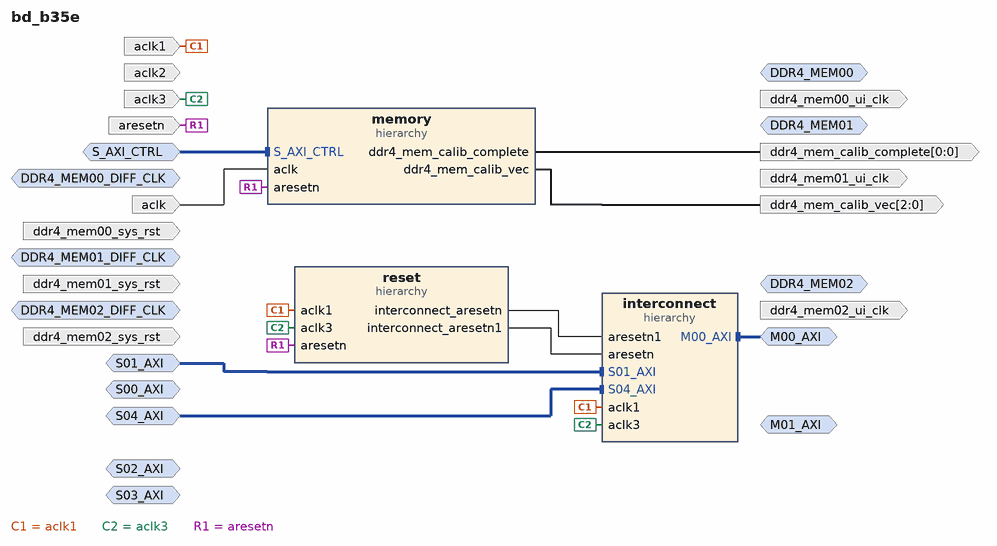
[diagram p0: block diagram of the top level]
# Vivado block design bd_b35e, xcu250-figd2104-2L-e, Vivado 2022.2
create_bd_design bd_b35e

create_bd_intf_port -mode Slave -vlnv xilinx.com:interface:aximm_rtl:1.0 S_AXI_CTRL
set_property -dict {CONFIG.ADDR_WIDTH 24 CONFIG.PROTOCOL AXI4LITE} [get_bd_intf_ports S_AXI_CTRL]
create_bd_intf_port -mode Slave -vlnv xilinx.com:interface:aximm_rtl:1.0 S00_AXI
set_property -dict {CONFIG.ADDR_WIDTH 39} [get_bd_intf_ports S00_AXI]
create_bd_intf_port -mode Slave -vlnv xilinx.com:interface:aximm_rtl:1.0 S01_AXI
set_property -dict {CONFIG.ADDR_WIDTH 39 CONFIG.master_id 1} [get_bd_intf_ports S01_AXI]
create_bd_intf_port -mode Slave -vlnv xilinx.com:interface:aximm_rtl:1.0 S02_AXI
set_property -dict {CONFIG.ADDR_WIDTH 39} [get_bd_intf_ports S02_AXI]
create_bd_intf_port -mode Slave -vlnv xilinx.com:interface:aximm_rtl:1.0 S03_AXI
set_property -dict {CONFIG.ADDR_WIDTH 39} [get_bd_intf_ports S03_AXI]
create_bd_intf_port -mode Slave -vlnv xilinx.com:interface:aximm_rtl:1.0 S04_AXI
set_property -dict {CONFIG.ADDR_WIDTH 39 CONFIG.master_id 2} [get_bd_intf_ports S04_AXI]
create_bd_intf_port -mode Master -vlnv xilinx.com:interface:ddr4_rtl:1.0 DDR4_MEM00
create_bd_intf_port -mode Master -vlnv xilinx.com:interface:ddr4_rtl:1.0 DDR4_MEM01
create_bd_intf_port -mode Master -vlnv xilinx.com:interface:ddr4_rtl:1.0 DDR4_MEM02
create_bd_intf_port -mode Slave -vlnv xilinx.com:interface:diff_clock_rtl:1.0 DDR4_MEM00_DIFF_CLK
set_property -dict {CONFIG.FREQ_HZ 300000000} [get_bd_intf_ports DDR4_MEM00_DIFF_CLK]
create_bd_intf_port -mode Slave -vlnv xilinx.com:interface:diff_clock_rtl:1.0 DDR4_MEM01_DIFF_CLK
set_property -dict {CONFIG.FREQ_HZ 300000000} [get_bd_intf_ports DDR4_MEM01_DIFF_CLK]
create_bd_intf_port -mode Slave -vlnv xilinx.com:interface:diff_clock_rtl:1.0 DDR4_MEM02_DIFF_CLK
set_property -dict {CONFIG.FREQ_HZ 300000000} [get_bd_intf_ports DDR4_MEM02_DIFF_CLK]
create_bd_intf_port -mode Master -vlnv xilinx.com:interface:aximm_rtl:1.0 M00_AXI
set_property -dict {CONFIG.ADDR_WIDTH 39} [get_bd_intf_ports M00_AXI]
create_bd_intf_port -mode Master -vlnv xilinx.com:interface:aximm_rtl:1.0 M01_AXI
set_property -dict {CONFIG.ADDR_WIDTH 38} [get_bd_intf_ports M01_AXI]
create_bd_port -dir I -type clk aclk
set_property -dict {CONFIG.ASSOCIATED_BUSIF S_AXI_CTRL} [get_bd_ports aclk]
create_bd_port -dir I -type clk aclk1
set_property -dict {CONFIG.ASSOCIATED_BUSIF S00_AXI:S01_AXI:S02_AXI:S03_AXI:S04_AXI} [get_bd_ports aclk1]
create_bd_port -dir I -type clk aclk2
set_property -dict {CONFIG.ASSOCIATED_BUSIF M01_AXI} [get_bd_ports aclk2]
create_bd_port -dir I -type clk aclk3
set_property -dict {CONFIG.ASSOCIATED_BUSIF M00_AXI} [get_bd_ports aclk3]
create_bd_port -dir I -type rst aresetn
create_bd_port -dir O -type clk ddr4_mem00_ui_clk
create_bd_port -dir O -type clk ddr4_mem01_ui_clk
create_bd_port -dir O -type clk ddr4_mem02_ui_clk
create_bd_port -dir I -type rst ddr4_mem00_sys_rst
set_property -dict {CONFIG.POLARITY ACTIVE_HIGH} [get_bd_ports ddr4_mem00_sys_rst]
create_bd_port -dir I -type rst ddr4_mem01_sys_rst
set_property -dict {CONFIG.POLARITY ACTIVE_HIGH} [get_bd_ports ddr4_mem01_sys_rst]
create_bd_port -dir I -type rst ddr4_mem02_sys_rst
set_property -dict {CONFIG.POLARITY ACTIVE_HIGH} [get_bd_ports ddr4_mem02_sys_rst]
create_bd_port -dir O -from 0 -to 0 -type data ddr4_mem_calib_complete
create_bd_port -dir O -from 2 -to 0 -type data ddr4_mem_calib_vec

create_bd_cell -type hier reset
create_bd_cell -type hier interconnect
create_bd_cell -type hier memory

# ---- hierarchy /reset ----
current_bd_instance /reset
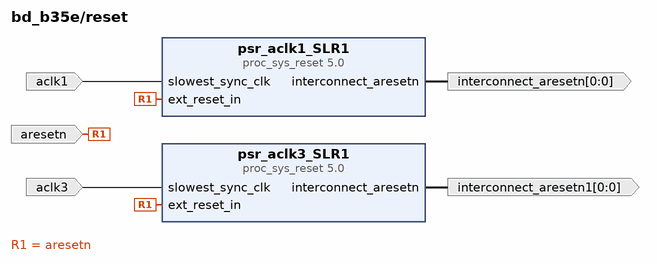
[diagram p1: block diagram inside /reset]
create_bd_pin -dir I -type clk aclk1
create_bd_pin -dir I -type rst aresetn
create_bd_pin -dir O -from 0 -to 0 -type rst interconnect_aresetn
create_bd_pin -dir I -type clk aclk3
create_bd_pin -dir O -from 0 -to 0 -type rst interconnect_aresetn1

create_bd_cell -type ip -vlnv xilinx.com:ip:proc_sys_reset:5.0 psr_aclk1_SLR1
set_property -dict {CONFIG.SLR_ASSIGNMENTS SLR1} [get_bd_cells psr_aclk1_SLR1]
create_bd_cell -type ip -vlnv xilinx.com:ip:proc_sys_reset:5.0 psr_aclk3_SLR1
set_property -dict {CONFIG.SLR_ASSIGNMENTS SLR1} [get_bd_cells psr_aclk3_SLR1]

# ---- hierarchy /interconnect ----
current_bd_instance /interconnect
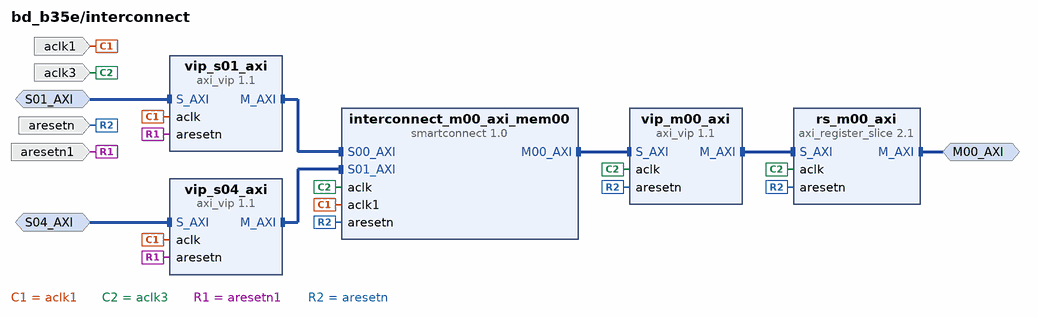
[diagram p2: block diagram inside /interconnect]
create_bd_intf_pin -mode Slave -vlnv xilinx.com:interface:aximm_rtl:1.0 S01_AXI
create_bd_intf_pin -mode Slave -vlnv xilinx.com:interface:aximm_rtl:1.0 S04_AXI
create_bd_intf_pin -mode Master -vlnv xilinx.com:interface:aximm_rtl:1.0 M00_AXI
create_bd_pin -dir I -type clk aclk3
create_bd_pin -dir I -type rst aresetn
create_bd_pin -dir I -type clk aclk1
create_bd_pin -dir I -type rst aresetn1

create_bd_cell -type ip -vlnv xilinx.com:ip:smartconnect:1.0 interconnect_m00_axi_mem00
set_property -dict [list \
  CONFIG.ADVANCED_PROPERTIES {['__view__ {', 'functional {S00_Buffer {R_SIZE 512 W_SIZE 512} S00_Entry {PKT_R_THR 512 LIM_R_LEN 256 PKT_W_THR 64 LIM_W_LEN 256} S01_Buffer {R_SIZE 512 W_SIZE 512} S01_Entry {PKT_R_THR 512 LIM_R_LEN 256 PKT_W_THR 64', 'LIM_W_LEN 256}}', '}']} \
  CONFIG.NUM_CLKS 2 \
  CONFIG.NUM_SI 2 \
] [get_bd_cells interconnect_m00_axi_mem00]
create_bd_cell -type ip -vlnv xilinx.com:ip:axi_vip:1.1 vip_s01_axi
create_bd_cell -type ip -vlnv xilinx.com:ip:axi_vip:1.1 vip_s04_axi
create_bd_cell -type ip -vlnv xilinx.com:ip:axi_vip:1.1 vip_m00_axi
create_bd_cell -type ip -vlnv xilinx.com:ip:axi_register_slice:2.1 rs_m00_axi
set_property -dict [list \
  CONFIG.ADDR_WIDTH 39 \
  CONFIG.ARUSER_WIDTH 0 \
  CONFIG.AWUSER_WIDTH 0 \
  CONFIG.BUSER_WIDTH 0 \
  CONFIG.DATA_WIDTH 512 \
  CONFIG.HAS_BRESP 1 \
  CONFIG.HAS_BURST 1 \
  CONFIG.HAS_CACHE 1 \
  CONFIG.HAS_LOCK 1 \
  CONFIG.HAS_PROT 1 \
  CONFIG.HAS_QOS 0 \
  CONFIG.HAS_REGION 0 \
  CONFIG.HAS_RRESP 1 \
  CONFIG.HAS_WSTRB 1 \
  CONFIG.ID_WIDTH 4 \
  CONFIG.MAX_BURST_LENGTH 256 \
  CONFIG.NUM_READ_OUTSTANDING 16 \
  CONFIG.NUM_READ_THREADS 2 \
  CONFIG.NUM_WRITE_OUTSTANDING 32 \
  CONFIG.NUM_WRITE_THREADS 2 \
  CONFIG.PROTOCOL AXI4 \
  CONFIG.READ_WRITE_MODE READ_WRITE \
  CONFIG.REG_AR 0 \
  CONFIG.REG_AW 0 \
  CONFIG.REG_B 0 \
  CONFIG.REG_R 0 \
  CONFIG.REG_W 0 \
  CONFIG.RUSER_BITS_PER_BYTE 0 \
  CONFIG.RUSER_WIDTH 0 \
  CONFIG.SUPPORTS_NARROW_BURST 0 \
  CONFIG.WUSER_BITS_PER_BYTE 0 \
  CONFIG.WUSER_WIDTH 0 \
] [get_bd_cells rs_m00_axi]

# ---- hierarchy /memory ----
current_bd_instance /memory
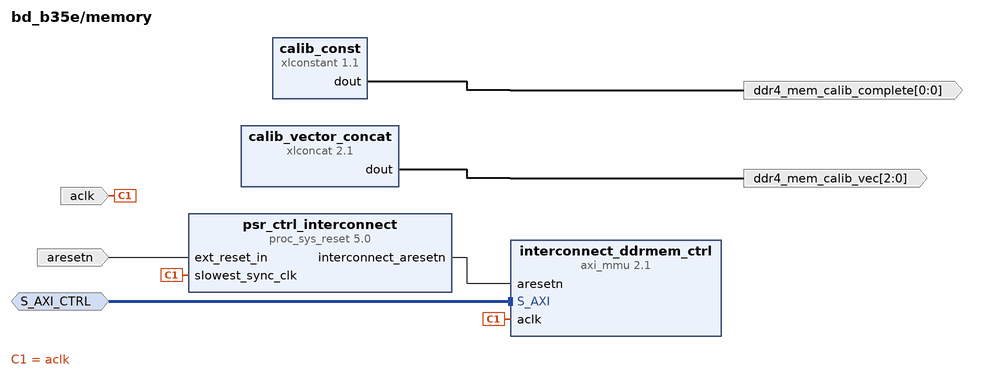
[diagram p3: block diagram inside /memory]
create_bd_intf_pin -mode Slave -vlnv xilinx.com:interface:aximm_rtl:1.0 S_AXI_CTRL
create_bd_pin -dir O -from 2 -to 0 ddr4_mem_calib_vec
create_bd_pin -dir I -type clk aclk
create_bd_pin -dir I -type rst aresetn
create_bd_pin -dir O -from 0 -to 0 ddr4_mem_calib_complete

create_bd_cell -type ip -vlnv xilinx.com:ip:xlconcat:2.1 calib_vector_concat
set_property -dict {CONFIG.NUM_PORTS 3} [get_bd_cells calib_vector_concat]
create_bd_cell -type ip -vlnv xilinx.com:ip:axi_mmu:2.1 interconnect_ddrmem_ctrl
create_bd_cell -type ip -vlnv xilinx.com:ip:proc_sys_reset:5.0 psr_ctrl_interconnect
create_bd_cell -type ip -vlnv xilinx.com:ip:xlconstant:1.1 calib_const

# ---- connections ----

current_bd_instance /reset
connect_bd_net -net aclk1_1 [get_bd_pins aclk1] [get_bd_pins psr_aclk1_SLR1/slowest_sync_clk]
connect_bd_net -net aclk3_1 [get_bd_pins aclk3] [get_bd_pins psr_aclk3_SLR1/slowest_sync_clk]
connect_bd_net [get_bd_pins aresetn] [get_bd_pins psr_aclk3_SLR1/ext_reset_in] [get_bd_pins psr_aclk1_SLR1/ext_reset_in]
connect_bd_net [get_bd_pins psr_aclk1_SLR1/interconnect_aresetn] [get_bd_pins interconnect_aresetn]
connect_bd_net [get_bd_pins psr_aclk3_SLR1/interconnect_aresetn] [get_bd_pins interconnect_aresetn1]

current_bd_instance /interconnect
connect_bd_intf_net [get_bd_intf_pins S01_AXI] [get_bd_intf_pins vip_s01_axi/S_AXI]
connect_bd_intf_net [get_bd_intf_pins S04_AXI] [get_bd_intf_pins vip_s04_axi/S_AXI]
connect_bd_intf_net [get_bd_intf_pins interconnect_m00_axi_mem00/M00_AXI] [get_bd_intf_pins vip_m00_axi/S_AXI]
connect_bd_intf_net [get_bd_intf_pins M00_AXI] [get_bd_intf_pins rs_m00_axi/M_AXI]
connect_bd_intf_net [get_bd_intf_pins vip_m00_axi/M_AXI] [get_bd_intf_pins rs_m00_axi/S_AXI]
connect_bd_intf_net [get_bd_intf_pins interconnect_m00_axi_mem00/S00_AXI] [get_bd_intf_pins vip_s01_axi/M_AXI]
connect_bd_intf_net [get_bd_intf_pins interconnect_m00_axi_mem00/S01_AXI] [get_bd_intf_pins vip_s04_axi/M_AXI]
connect_bd_net -net aclk1_1 [get_bd_pins aclk1] \
  [get_bd_pins vip_s01_axi/aclk] [get_bd_pins vip_s04_axi/aclk] [get_bd_pins interconnect_m00_axi_mem00/aclk1]
connect_bd_net -net aclk3_1 [get_bd_pins aclk3] \
  [get_bd_pins vip_m00_axi/aclk] [get_bd_pins rs_m00_axi/aclk] [get_bd_pins interconnect_m00_axi_mem00/aclk]
connect_bd_net -net psr_aclk1_SLR1_interconnect_aresetn [get_bd_pins aresetn1] [get_bd_pins vip_s04_axi/aresetn] [get_bd_pins vip_s01_axi/aresetn]
connect_bd_net -net psr_aclk3_SLR1_interconnect_aresetn [get_bd_pins aresetn] \
  [get_bd_pins vip_m00_axi/aresetn] [get_bd_pins rs_m00_axi/aresetn] [get_bd_pins interconnect_m00_axi_mem00/aresetn]

current_bd_instance /memory
connect_bd_intf_net [get_bd_intf_pins S_AXI_CTRL] [get_bd_intf_pins interconnect_ddrmem_ctrl/S_AXI]
connect_bd_net [get_bd_pins aclk] [get_bd_pins psr_ctrl_interconnect/slowest_sync_clk] [get_bd_pins interconnect_ddrmem_ctrl/aclk]
connect_bd_net [get_bd_pins aresetn] [get_bd_pins psr_ctrl_interconnect/ext_reset_in]
connect_bd_net [get_bd_pins calib_const/dout] [get_bd_pins ddr4_mem_calib_complete]
connect_bd_net [get_bd_pins calib_vector_concat/dout] [get_bd_pins ddr4_mem_calib_vec]
connect_bd_net [get_bd_pins psr_ctrl_interconnect/interconnect_aresetn] [get_bd_pins interconnect_ddrmem_ctrl/aresetn]

current_bd_instance /
connect_bd_intf_net [get_bd_intf_ports S01_AXI] [get_bd_intf_pins interconnect/S01_AXI]
connect_bd_intf_net [get_bd_intf_ports S04_AXI] [get_bd_intf_pins interconnect/S04_AXI]
connect_bd_intf_net [get_bd_intf_ports S_AXI_CTRL] [get_bd_intf_pins memory/S_AXI_CTRL]
connect_bd_intf_net -intf_net rs_M00_AXI_M_AXI [get_bd_intf_ports M00_AXI] [get_bd_intf_pins interconnect/M00_AXI]
connect_bd_net -net aclk1_1 [get_bd_ports aclk1] [get_bd_pins reset/aclk1] [get_bd_pins interconnect/aclk1]
# net aclk2_1 has one end: aclk2
connect_bd_net -net aclk3_1 [get_bd_ports aclk3] [get_bd_pins reset/aclk3] [get_bd_pins interconnect/aclk3]
connect_bd_net [get_bd_ports aclk] [get_bd_pins memory/aclk]
connect_bd_net [get_bd_ports aresetn] [get_bd_pins reset/aresetn] [get_bd_pins memory/aresetn]
connect_bd_net -net calib_const_dout [get_bd_pins memory/ddr4_mem_calib_complete] [get_bd_ports ddr4_mem_calib_complete]
connect_bd_net -net calib_vector_concat_dout [get_bd_pins memory/ddr4_mem_calib_vec] [get_bd_ports ddr4_mem_calib_vec]
connect_bd_net -net psr_aclk1_SLR1_interconnect_aresetn [get_bd_pins reset/interconnect_aresetn] [get_bd_pins interconnect/aresetn1]
connect_bd_net -net psr_aclk3_SLR1_interconnect_aresetn [get_bd_pins reset/interconnect_aresetn1] [get_bd_pins interconnect/aresetn]

# ---- address map ----
assign_bd_address -offset 0x5000000000 -range 16G -target_address_space [get_bd_addr_spaces S01_AXI] [get_bd_addr_segs M00_AXI/Reg]
assign_bd_address -offset 0x5000000000 -range 16G -target_address_space [get_bd_addr_spaces S04_AXI] [get_bd_addr_segs M00_AXI/Reg]

validate_bd_design
save_bd_design
